# Altium schematic sheet 电子钟v1.SchDoc
size A4
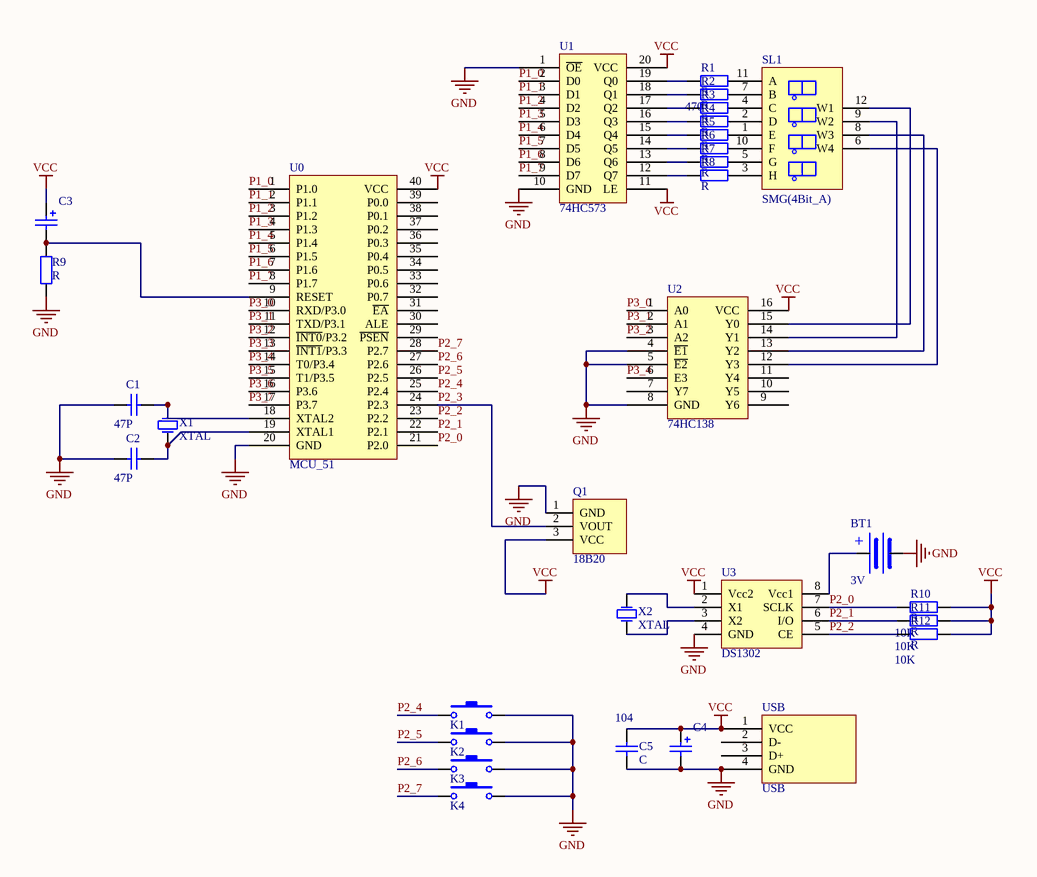
[diagram p0: 电子钟v1.SchDoc]

## Parts
BT1  3V  [DCH_22]
C1  SIZE: 47P  [瓷片电容]  (hidden comment: 47pf)
C2  SIZE: 47P  [瓷片电容]  (hidden comment: C)
C3  CD  [电解电容（小型）]  (value not drawn)
C4  CD  [电解电容（小型）]  (value not drawn)
C5  C  SIZE: 104  [瓷片电容]
K1  switch-anniu  [6*6按钮开关]  (value not drawn)
K2  switch-anniu  [6*6按钮开关]  (value not drawn)
K3  switch-anniu  [6*6按钮开关]  (value not drawn)
K4  switch-anniu  [6*6按钮开关]  (value not drawn)
Q1  18B20  [三极管（小体3个脚）]
R1  R  SIZE: 470  [电阻-0.25W]
R2  R  [电阻-0.25W]
R3  R  [电阻-0.25W]
R4  R  [电阻-0.25W]
R5  R  [电阻-0.25W]
R6  R  [电阻-0.25W]
R7  R  [电阻-0.25W]
R8  R  [电阻-0.25W]
R9  R  [电阻-0.25W]
R10  R  SIZE: 10K  [电阻-0.25W]
R11  R  SIZE: 10K  [电阻-0.25W]
R12  R  SIZE: 10K  [电阻-0.25W]
SL1  SMG(4Bit_A)  [4位数码管（19*50mm）]
U0  MCU_51  [DIP-40]
U1  74HC573  [DIP20插座]
U2  74HC138  [DIP16插座]
U3  DS1302  [DIP-8]
USB  USB  [USB阴头]
X1  XTAL  [无源晶体（2个脚）]
X2  XTAL  [无源晶体（小）]

## Nets
GND: BT1.2(GND) C1.1 C2.1 C4.2 C5.1 K1.2 K2.2 K3.2 K4.2 Q1.1(GND) R9.1 U0.20(GND) U1.1(~{OE}) U1.10(GND) U2.4(~{E1}) U2.5(~{E2}) U2.8(GND) U3.4(GND) USB.4(GND)
VCC: C3.1 C4.1 C5.2 Q1.3(VCC) R10.2 R11.2 R12.2 U0.40(VCC) U1.11(LE) U1.20(VCC) U2.16(VCC) U3.1(Vcc2) USB.1(VCC)
P1_0: U0.1(P1.0) U1.2(D0)
P1_1: U0.2(P1.1) U1.3(D1)
P1_2: U0.3(P1.2) U1.4(D2)
P1_3: U0.4(P1.3) U1.5(D3)
P1_4: U0.5(P1.4) U1.6(D4)
P1_5: U0.6(P1.5) U1.7(D5)
P1_6: U0.7(P1.6) U1.8(D6)
P1_7: U0.8(P1.7) U1.9(D7)
P2_0: R10.1 U0.21(P2.0) U3.7(SCLK)
P2_1: R11.1 U0.22(P2.1) U3.6(I/O)
P2_2: R12.1 U0.23(P2.2) U3.5(CE)
P2_3: Q1.2(VOUT) U0.24(P2.3)
P2_4: K1.1 U0.25(P2.4)
P2_5: K2.1 U0.26(P2.5)
P2_6: K3.1 U0.27(P2.6)
P2_7: K4.1 U0.28(P2.7)
P3_0: U0.10(RXD/P3.0) U2.1(A0)
P3_1: U0.11(TXD/P3.1) U2.2(A1)
P3_2: U0.12(~{INT0}/P3.2) U2.3(A2)
P3_3: U0.13(~{INT1}/P3.3)
P3_4: U0.14(T0/P3.4) U2.6(E3)
P3_5: U0.15(T1/P3.5)
P3_6: U0.16(P3.6)
P3_7: U0.17(P3.7)
NetBT1_1: BT1.1(VCC) U3.8(Vcc1)
NetC1_2: C1.2 U0.18(XTAL2) X1.2(OSC2)
NetC2_2: C2.2 U0.19(XTAL1) X1.1(OSC1)
NetC3_2: C3.2 R9.2 U0.9(RESET)
NetR1_1: R1.1 U1.19(Q0)
NetR1_2: R1.2 SL1.11(A)
NetR2_1: R2.1 U1.18(Q1)
NetR2_2: R2.2 SL1.7(B)
NetR3_1: R3.1 U1.17(Q2)
NetR3_2: R3.2 SL1.4(C)
NetR4_1: R4.1 U1.16(Q3)
NetR4_2: R4.2 SL1.2(D)
NetR5_1: R5.1 U1.15(Q4)
NetR5_2: R5.2 SL1.1(E)
NetR6_1: R6.1 U1.14(Q5)
NetR6_2: R6.2 SL1.10(F)
NetR7_1: R7.1 U1.13(Q6)
NetR7_2: R7.2 SL1.5(G)
NetR8_1: R8.1 U1.12(Q7)
NetR8_2: R8.2 SL1.3(H)
NetSL1_6: SL1.6(W4) U2.12(Y3)
NetSL1_8: SL1.8(W3) U2.13(Y2)
NetSL1_9: SL1.9(W2) U2.14(Y1)
NetSL1_12: SL1.12(W1) U2.15(Y0)
NetU3_2: U3.2(X1) X2.2(OSC2)
NetU3_3: U3.3(X2) X2.1(OSC1)

Not connected (* = marked no-connect by the designer): U0 29(~{PSEN}) 30(ALE) 31(~{EA}) 32(P0.7) 33(P0.6) 34(P0.5) 35(P0.4) 36(P0.3) 37(P0.2) 38(P0.1) 39(P0.0); U2 7(Y7) 9(Y6) 10(Y5) 11(Y4); USB 2(D-) 3(D+)

## Notes on the sheet
- (in symbol BATTER) +
- (in symbol SMG(4Bit_A)) 。

## Library data of the parts
BT1 = BATTER
C1 = C
C3 C4 = CD: SIZE: 16V/10uF
R1-R12 = R
  R2-R9: SIZE: 1K
U0 = MCU_51: size: *